# Altium schematic sheet microcontroller.SchDoc: Microcontroller
size A3; Author: Pietro Lorefice; Organization: DB Home System
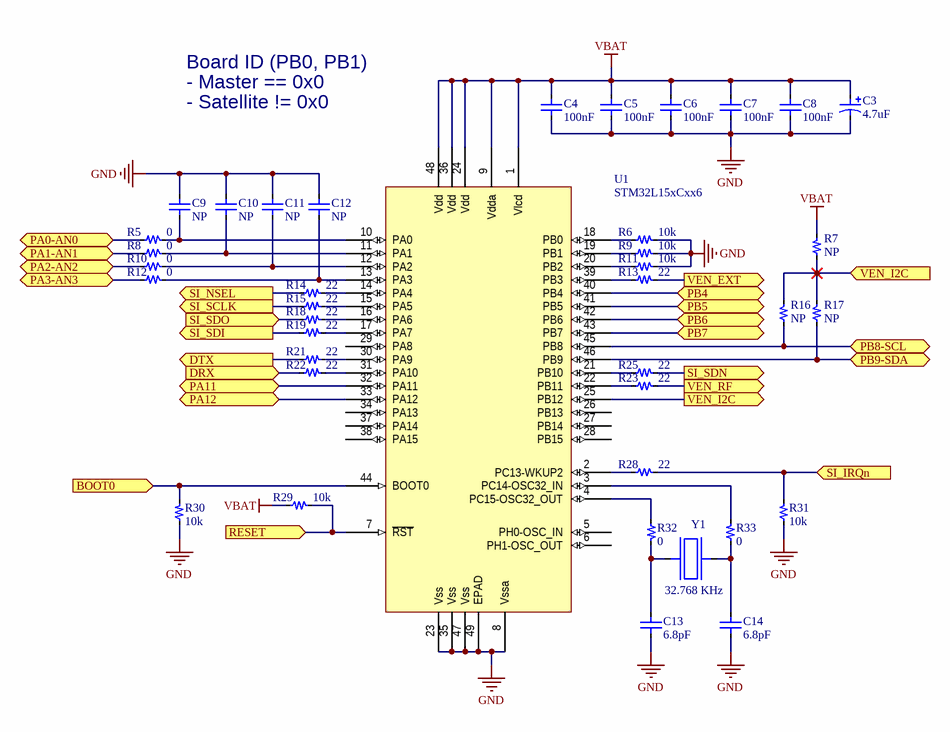
[diagram p0: microcontroller.SchDoc]

## Parts
C3  4.7uF  [0603_[1608]]
C4  100nF  [0603_[1608]]
C5  100nF  [0603_[1608]]
C6  100nF  [0603_[1608]]
C7  100nF  [0603_[1608]]
C8  100nF  [0603_[1608]]
C9  NP  [0603_[1608]]
C10  NP  [0603_[1608]]
C11  NP  [0603_[1608]]
C12  NP  [0603_[1608]]
C13  6.8pF  [0603_[1608]]
C14  6.8pF  [0603_[1608]]
R5  0  [0603_[1608]]
R6  10k  [0603_[1608]]
R7  NP  [0603_[1608]]
R8  0  [0603_[1608]]
R9  10k  [0603_[1608]]
R10  0  [0603_[1608]]
R11  10k  [0603_[1608]]
R12  0  [0603_[1608]]
R13  22  [0603_[1608]]
R14  22  [0603_[1608]]
R15  22  [0603_[1608]]
R16  NP  [0603_[1608]]
R17  NP  [0603_[1608]]
R18  22  [0603_[1608]]
R19  22  [0603_[1608]]
R21  22  [0603_[1608]]
R22  22  [0603_[1608]]
R23  22  [0603_[1608]]
R25  22  [0603_[1608]]
R28  22  [0603_[1608]]
R29  10k  [0603_[1608]]
R30  10k  [0603_[1608]]
R31  10k  [0603_[1608]]
R32  0  [0603_[1608]]
R33  0  [0603_[1608]]
U1  STM32L15xCxx6  [QFN50P700X700X60_HS-49N]
Y1  32.768 KHz  [KX-38]

## Ports
BOOT0 (in), DRX (in), DTX (out), PA0-AN0 (bidir), PA1-AN1 (bidir), PA2-AN2 (bidir), PA3-AN3 (bidir), PA11 (bidir), PA12 (bidir), PB4 (bidir), PB5 (bidir), PB6 (bidir), PB7 (bidir), PB8-SCL (bidir), PB9-SDA (bidir), RESET (in), SI_IRQn (in), SI_NSEL (out), SI_SCLK (out), SI_SDI (out), SI_SDN (out), SI_SDO (in), VEN_EXT (out), VEN_I2C (in), VEN_I2C (out), VEN_RF (out)

## Nets
GND: C3.2 C4.1 C5.1 C6.1 C7.1 C8.1 C9.2 C10.2 C11.2 C12.2 C13.1 C14.1 R6.2 R9.2 R11.2 R30.1 R31.1 U1.8(Vssa) U1.23(Vss) U1.35(Vss) U1.47(Vss) U1.49(EPAD)
VBAT: C3.1 C4.2 C5.2 C6.2 C7.2 C8.2 R7.2 R29.1 U1.1(Vlcd) U1.9(Vdda) U1.24(Vdd) U1.36(Vdd) U1.48(Vdd)
BOOT0: R30.2 U1.44(BOOT0) ; port BOOT0
DRX: R22.1 ; port DRX
DTX: R21.1 ; port DTX
PA0-AN0: R5.1 ; port PA0-AN0
PA1-AN1: R8.1 ; port PA1-AN1
PA2-AN2: R10.1 ; port PA2-AN2
PA3-AN3: R12.1 ; port PA3-AN3
PA11: U1.32(PA11) ; port PA11
PA12: U1.33(PA12) ; port PA12
PB4: U1.40(PB4) ; port PB4
PB5: U1.41(PB5) ; port PB5
PB6: U1.42(PB6) ; port PB6
PB7: U1.43(PB7) ; port PB7
PB8-SCL: R16.1 U1.45(PB8) ; port PB8-SCL
PB9-SDA: R17.1 U1.46(PB9) ; port PB9-SDA
RESET: R29.2 U1.7(~{RST}) ; port RESET
SI_IRQn: R28.2 R31.2 ; port SI_IRQn
SI_NSEL: R14.1 ; port SI_NSEL
SI_SCLK: R15.1 ; port SI_SCLK
SI_SDI: R19.1 ; port SI_SDI
SI_SDN: R25.2 ; port SI_SDN
SI_SDO: R18.1 ; port SI_SDO
VEN_EXT: R13.2 ; port VEN_EXT
VEN_I2C: R7.1 R16.2 R17.2 U1.25(PB12) ; port VEN_I2C
VEN_RF: R23.2 ; port VEN_RF
NetC9_1: C9.1 R5.2 U1.10(PA0)
NetC10_1: C10.1 R8.2 U1.11(PA1)
NetC11_1: C11.1 R10.2 U1.12(PA2)
NetC12_1: C12.1 R12.2 U1.13(PA3)
NetC13_2: C13.2 R32.2 Y1.1
NetC14_2: C14.2 R33.1 Y1.2
NetR6_1: R6.1 U1.18(PB0)
NetR9_1: R9.1 U1.19(PB1)
NetR11_1: R11.1 U1.20(PB2)
NetR13_1: R13.1 U1.39(PB3)
NetR14_2: R14.2 U1.14(PA4)
NetR15_2: R15.2 U1.15(PA5)
NetR18_2: R18.2 U1.16(PA6)
NetR19_2: R19.2 U1.17(PA7)
NetR21_2: R21.2 U1.30(PA9)
NetR22_2: R22.2 U1.31(PA10)
NetR23_1: R23.1 U1.22(PB11)
NetR25_1: R25.1 U1.21(PB10)
NetR28_1: R28.1 U1.2(PC13-WKUP2)
NetR32_1: R32.1 U1.4(PC15-OSC32_OUT)
NetR33_2: R33.2 U1.3(PC14-OSC32_IN)

Not connected (* = marked no-connect by the designer): U1 5(PH0-OSC_IN) 6(PH1-OSC_OUT) 26(PB13) 27(PB14) 28(PB15) 29(PA8) 34(PA13) 37(PA14) 38(PA15)

## Notes on the sheet
- Board ID (PB0, PB1)
- - Master == 0x0
- - Satellite != 0x0
- Project:
- Title:
- Author:
- Licensed:
- Rev:
- Size:
- A3
- File:
- Date:
- Sheet
- of

## Library data of the parts
C3 = CPOL: Polarized capacitor; Value: 4.7uF
C4-C8 C13 C14 = C: Capacitor
  C4-C8: Value: 100nF
  C13 C14: Value: 6.8pF
C9-C12 = C: Capacitor; Value: 100nF
R5 R6 R8-R15 R18 R19 R21-R23 R25 R28-R33 = R: Resistor
  R5 R8 R10 R12 R32 R33: Value: 0
  R6 R9 R11 R29-R31: Value: 10k
  R13-R15 R18 R19 R21-R23 R25 R28: Value: 22
R7 = R: Resistor; Value: 0
R16 R17 = R: Resistor; Value: 10K
U1 = STM32L15xCxx6: Ultra-low-power 32-bit MCU ARM®-based Cortex®-M3, 128KB Flash, 16KB SRAM, 4KB EEPROM, LCD, USB, ADC, DAC
Y1 = XTAL: Crystal oscillator; Value: 32.768 KHz